# EAGLE schematic FlashPanelV5_2 (EAGLE 7.2.0)
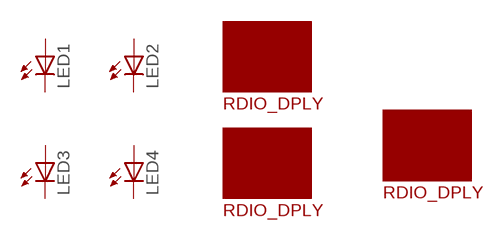
[diagram p0: schematic, sheet 1]

## Parts
LED1  CXM27  [CXM27]
LED2  CXM27  [CXM27]
LED3  CXM27  [CXM27]
LED4  CXM27  [CXM27]
RDIO1  RDIO  [RDIO_DPLY]
RDIO2  RDIO  [RDIO_DPLY]
RDIO3  RDIO  [RDIO_DPLY]
Unconnected: LED1.ANODE(A) LED1.CATHODE(C) LED2.ANODE(A) LED2.CATHODE(C) LED3.ANODE(A) LED3.CATHODE(C) LED4.ANODE(A) LED4.CATHODE(C)

## Library data of the parts
LED1-LED4 = cxm27:CXM27
RDIO1-RDIO3 = rdio_deploy:RDIO